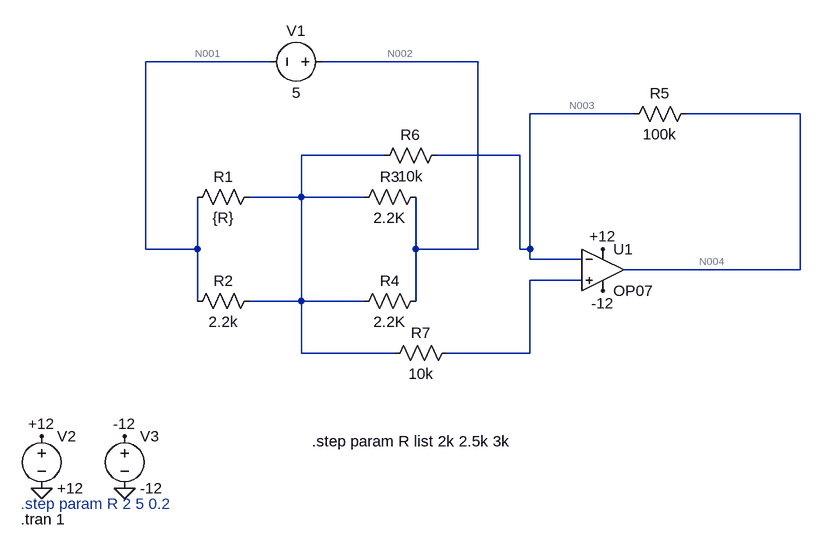
[diagram p0: schematic hw7-2.asc]
hw7-2.asc, the LTspice schematic file:
Version 4.1
SHEET 1 1796 680
WIRE 128 -128 -64 -128
WIRE 448 -128 208 -128
WIRE 688 -48 528 -48
WIRE 944 -48 768 -48
WIRE 304 16 176 16
WIRE 512 16 384 16
WIRE 176 80 176 16
WIRE 176 80 96 80
WIRE 272 80 176 80
WIRE -64 160 -64 -128
WIRE 16 160 16 80
WIRE 16 160 -64 160
WIRE 352 160 352 80
WIRE 448 160 448 -128
WIRE 448 160 352 160
WIRE 512 160 512 16
WIRE 528 160 528 -48
WIRE 528 160 512 160
WIRE 528 176 528 160
WIRE 608 176 528 176
WIRE 944 192 944 -48
WIRE 944 192 672 192
WIRE 608 208 528 208
WIRE 16 240 16 160
WIRE 176 240 176 80
WIRE 176 240 96 240
WIRE 272 240 176 240
WIRE 352 240 352 160
WIRE 176 320 176 240
WIRE 320 320 176 320
WIRE 528 320 528 208
WIRE 528 320 400 320
FLAG -224 528 0
FLAG -96 528 0
FLAG -224 448 +12
FLAG -96 448 -12
FLAG 640 160 +12
FLAG 640 224 -12
SYMBOL res 0 96 R270
WINDOW 0 32 56 VTop 2
WINDOW 3 0 56 VBottom 2
SYMATTR InstName R1
SYMATTR Value {R}
SYMBOL res 256 96 R270
WINDOW 0 32 56 VTop 2
WINDOW 3 0 56 VBottom 2
SYMATTR InstName R3
SYMATTR Value 2.2K
SYMBOL res 0 256 R270
WINDOW 0 32 56 VTop 2
WINDOW 3 0 56 VBottom 2
SYMATTR InstName R2
SYMATTR Value 2.2k
SYMBOL res 256 256 R270
WINDOW 0 32 56 VTop 2
WINDOW 3 0 56 VBottom 2
SYMATTR InstName R4
SYMATTR Value 2.2K
SYMBOL voltage 224 -128 R90
WINDOW 0 -32 56 VBottom 2
WINDOW 3 32 56 VTop 2
WINDOW 123 0 0 Left 0
WINDOW 39 0 0 Left 0
SYMATTR InstName V1
SYMATTR Value 5
SYMBOL voltage -224 432 R0
WINDOW 123 0 0 Left 0
WINDOW 39 0 0 Left 0
SYMATTR InstName V2
SYMATTR Value +12
SYMBOL voltage -96 432 R0
WINDOW 123 0 0 Left 0
WINDOW 39 0 0 Left 0
SYMATTR InstName V3
SYMATTR Value -12
SYMBOL OpAmps\\OP07 640 128 R0
SYMATTR InstName U1
SYMBOL res 784 -64 R90
WINDOW 0 0 56 VBottom 2
WINDOW 3 32 56 VTop 2
SYMATTR InstName R5
SYMATTR Value 100k
SYMBOL res 400 0 R90
WINDOW 0 0 56 VBottom 2
WINDOW 3 32 56 VTop 2
SYMATTR InstName R6
SYMATTR Value 10k
SYMBOL res 416 304 R90
WINDOW 0 0 56 VBottom 2
WINDOW 3 32 56 VTop 2
SYMATTR InstName R7
SYMATTR Value 10k
TEXT -256 552 Left 2 ;.step param R 2 5 0.2
TEXT 192 456 Left 2 !.step param R list 2k 2.5k 3k
TEXT -256 576 Left 2 !.tran 1

The netlist it stands for:
* hw7-2.asc
R1 N001 N005 {R}
R3 N005 N002 2.2K
R2 N001 N005 2.2k
R4 N005 N002 2.2K
V1 N002 N001 5
V2 +12 0 +12
V3 -12 0 -12
X§U1 N006 N003 +12 -12 N004 LT1001  ; OP07, pins In+ In- V+ V- OUT
R5 N004 N003 100k
R6 N003 N005 10k
R7 N006 N005 10k
* .step param R 2 5 0.2
.step param R list 2k 2.5k 3k
.tran 1
.lib LTC.lib
.backanno
.end

* Results of the author's LTspice run, read from the files saved beside the schematic
* Operating Point (first step), zero values left out:
*   V(+12) = 12 V
*   V(-12) = -12 V
*   V(n001) = -2.439 V
*   V(n002) = 2.561 V
*   I(R2) = -1.109 mA
*   I(V1) = -2.328 mA
*   I(R1) = -1.22 mA
*   I(V2) = -2.25 mA
*   I(R3) = -1.164 mA
*   I(R4) = -1.164 mA
*   I(V3) = 2.25 mA
*   Ix(u1:3) = 2.25 mA
*   Ix(u1:4) = -2.25 mA
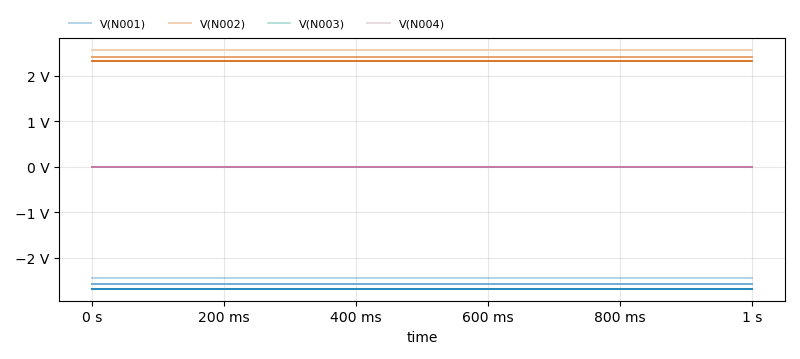
[diagram p1: Transient Analysis of hw7-2.asc, plotted from the saved traces]
* Transient Analysis, 3 runs:
*   V(N001) [r=2000]: min -2.439 V, max -2.439 V, average -2.439 V, rms 2.439 V, last -2.439 V
*   V(N001) [r=2500]: min -2.577 V, max -2.577 V, average -2.577 V, rms 2.577 V, last -2.577 V
*   V(N001) [r=3000]: min -2.679 V, max -2.679 V, average -2.679 V, rms 2.679 V, last -2.679 V
*   V(N002) [r=2000]: min 2.561 V, max 2.561 V, average 2.561 V, rms 2.561 V, last 2.561 V
*   V(N002) [r=2500]: min 2.423 V, max 2.423 V, average 2.423 V, rms 2.423 V, last 2.423 V
*   V(N002) [r=3000]: min 2.321 V, max 2.321 V, average 2.321 V, rms 2.321 V, last 2.321 V
*   V(N003) [r=2000]: min -6.304 nV, max -6.304 nV, average -6.304 nV, rms 6.304 nV, last -6.304 nV
*   V(N003) [r=2500]: min -2.286e-11 fV, max 1.094e-10 fV, average 4.234e-11 fV, rms 7.826e-11 fV, last 2.02e-11 fV
*   V(N003) [r=3000]: min -6.304 nV, max -6.304 nV, average -6.304 nV, rms 6.304 nV, last -6.304 nV
*   V(N004) [r=2000]: min -6.304 nV, max -6.304 nV, average -6.304 nV, rms 6.304 nV, last -6.304 nV
*   V(N004) [r=2500]: min -2.287e-11 fV, max 1.094e-10 fV, average 4.234e-11 fV, rms 7.826e-11 fV, last 2.021e-11 fV
*   V(N004) [r=3000]: min -6.304 nV, max -6.304 nV, average -6.304 nV, rms 6.304 nV, last -6.304 nV